# EasyEDA Pro project ProProject_PCB_Prometheus_main.epro

# Schematic Schematic1
Board Name: Board1; Create Date: 2025-01-10; Page Name: P1; Project Name: vr_tag; Schematic Name: Schematic1; Update Date: 2025-08-10; Company: EasyEDA.com; Page Size: A4; Version: V1.0
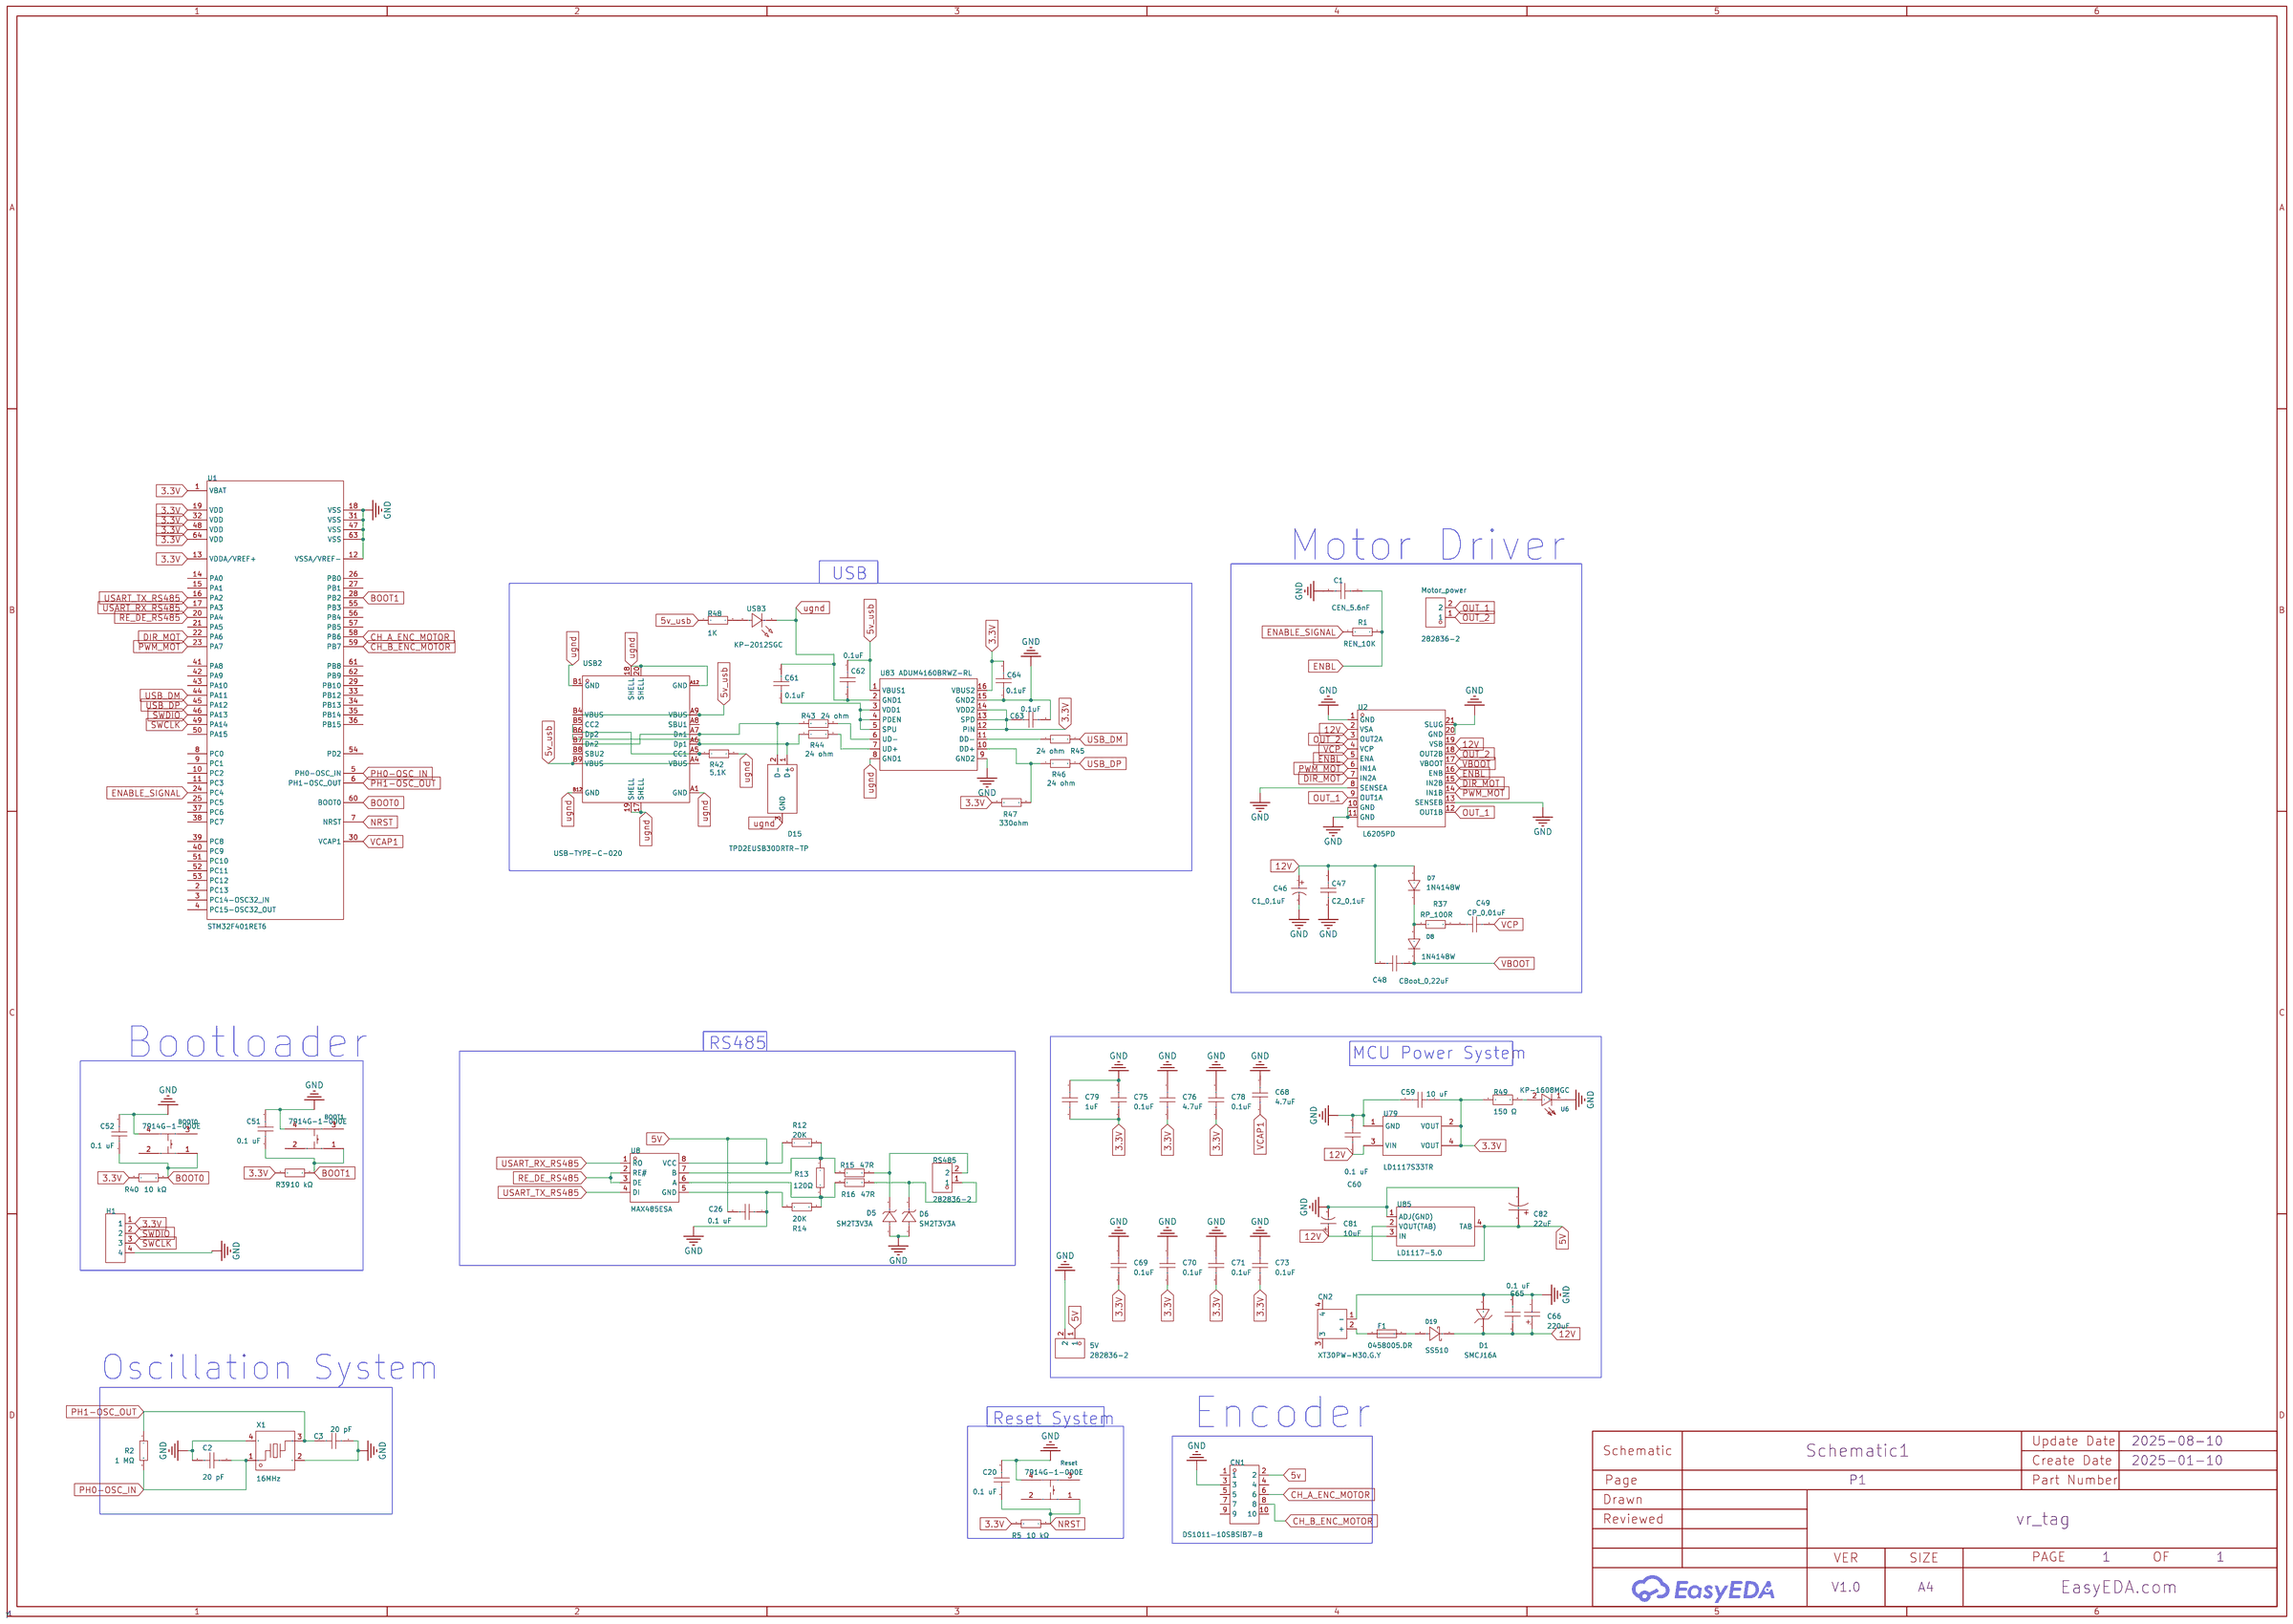
[diagram p0: schematic sheet]

## Parts
5V  282836-2  [CONN-TH_2P-P5.00_282836-2]
BOOT0  7914G-1-000E  [KEY-SMD_4P-L5.0-W5.0-P2.54-LS5.5-BL]
BOOT1  7914G-1-000E  [KEY-SMD_4P-L5.0-W5.0-P2.54-LS5.5-BL]
C1  CEN_5.6nF  [C0603]
C2  20 pF  [C0603]
C3  20 pF  [C0603]
C20  0.1 uF  [C0603]
C26  0.1 uF  [C0603]
C46  C1_0,1uF  [CASE-A_3216]
C47  C2_0,1uF  [C0603]
C48  CBoot_0,22uF  [C0603]
C49  CP_0,01uF  [C0603]
C51  0.1 uF  [C0603]
C52  0.1 uF  [C0603]
C59  10 uF  [C0603]
C60  0.1 uF  [C0603]
C61  0.1uF  [C0603]
C62  0.1uF  [C0603]
C63  0.1uF  [C0603]
C64  0.1uF  [C0603]
C65  0.1 uF  [C0603]
C66  220uF  [CASE-E_7343]
C68  4.7uF  [C0603]
C69  0.1uF  [C0603]
C70  0.1uF  [C0603]
C71  0.1uF  [C0603]
C73  0.1uF  [C0603]
C75  0.1uF  [C0603]
C76  4.7uF  [C0603]
C78  0.1uF  [C0603]
C79  1uF  [C0603]
C81  10uF  [CAP-SMD_BD5.0-L5.3-W5.3-LS6.3-FD]
C82  22uF  [CAP-SMD_BD5.0-L5.3-W5.3-LS6.3-FD]
CN1  DS1011-10SBSiB7-B  [CONN-TH_DS1011-10SBSIB7-B]
CN2  XT30PW-M30.G.Y  [CONN-TH_XT30PW-M]
D1  SMCJ16A  [SMC_L6.9-W5.9-LS7.9-RD]
D5  SM2T3V3A  [DO-216AA_L1.9-W1.9-LS3.8-FD]
D6  SM2T3V3A  [DO-216AA_L1.9-W1.9-LS3.8-FD]
D7  1N4148W  [SOD-123FL_L2.7-W1.6-LS3.8-RD]
D8  1N4148W  [SOD-123FL_L2.7-W1.6-LS3.8-RD]
D15  TPD2EUSB30DRTR-TP  [SOT-723-3_L1.2-W0.8-LS1.20-BR]
D19  SS510  [SMB_L4.3-W3.6-LS5.4-RD]
F1  0458005.DR  [F1206]
H1  -  [HDR-TH_4P-P2.54-V-M]
Motor_power  282836-2  [CONN-TH_2P-P5.00_282836-2]
R1  REN_10K  [R0603]
R2  1 MΩ  [R0603]
R5  10 kΩ  [R0603]
R12  20K  [R0603]
R13  120Ω  [R1206]
R14  20K  [R0603]
R15  47R  [R0603]
R16  47R  [R0603]
R37  RP_100R  [R0603]
R39  10 kΩ  [R0603]
R40  10 kΩ  [R0603]
R42  5,1K  [R0603]
R43  24 ohm  [R0603]
R44  24 ohm  [R0603]
R45  24 ohm  [R0603]
R46  24 ohm  [R0603]
R47  330ohm  [R0603]
R48  1K  [R0603]
R49  150 Ω  [R0805]
Reset  7914G-1-000E  [KEY-SMD_4P-L5.0-W5.0-P2.54-LS5.5-BL]
RS485  282836-2  [CONN-TH_2P-P5.00_282836-2]
U1  STM32F401RET6  [LQFP-64_L10.0-W10.0-P0.50-LS12.0-BL]
U2  L6205PD  [POWERSO20_L15.9-W11.0-P1.27-LS14.2-BL-EP]
U6  KP-1608MGC  [LED0603-RD_GREEN]
U8  MAX485ESA  [SOIC-8_L4.9-W3.9-P1.27-LS6.0-BL]
U79  LD1117S33TR  [SOT-223_L6.5-W3.5-P2.30-LS7.0-BR]
U83  ADUM4160BRWZ-RL  [SOIC-16_L10.3-W7.5-P1.27-LS10.3-BL]
U85  LD1117-5.0  [SOT-223_L6.7-W3.5-P2.30-BR]
USB2  USB-TYPE-C-020  [USB-SMD_USB-TYPE-C-020]
USB3  KP-2012SGC  [LED0805-RD]
X1  16MHz  [CRYSTAL-SMD_4P-L5.0-W3.2-BL]

## Library data of the parts
5V Motor_power RS485 = 282836-2: Pitch:5mm Color:Green Mounting Style:Direct Insert Current Rating (Max):13.5A Voltage Rating (Max):300V Number of Pins:2P Number of Rows:1 Wire Gauge - AWG:16~30 Wire Gauge - AWG:16~30 Number of PINs Per Row:2; LCSC Part Name: 5mm 排数:1 每排P数:2 直插; Supplier Part: C590402; Manufacturer: TE Connectivity(泰科电子); Supplier Footprint: 插件,P=5mm; JLCPCB Part Class: Extended Part; Datasheet: https://atta.szlcsc.com/upload/public/pdf/source/20240119/1DE6D9456CCE01F1F664469E3029A1B4.pdf; Supplier: LCSC; Pitch: 5mm; Color: Green; Mounting Style: Direct Insert; Current Rating (Max): 13.5A; Voltage Rating (Max): 300V; Number of Pins: 2P; Number of Rows: 1; Wire Gauge - AWG: 16~30; Number of PINs Per Row: 2
BOOT0 BOOT1 Reset = 7914G-1-000E: Circuit:SPST-常开 Actuator Style:Round Button Operating Force:300gf Mounting Style:Brick nogging Contact Current:100mA Voltage Rating (DC):16V IP Rating:IP67 Pin Style:Gull Wing Operating Temperature:-55℃~+125℃ Operating Temperature:-55℃~+125℃; Supplier Part: C840653; Manufacturer: BOURNS; JLCPCB Part Class: Extended Part; Supplier: LCSC; Circuit: SPST-常开; Actuator Style: Round Button; Operating Force: 300gf; Mounting Style: Brick nogging; Contact Current: 100mA; Voltage Rating (DC): 16V; IP Rating: IP67; Pin Style: Gull Wing; Operating Temperature: -55℃~+125℃
C1-C3 C20 C26 C47-C49 C51 C52 C59-C65 C68-C71 C73 C75 C76 C78 C79 = CAP_0603: Supplier Footprint: 0603
C46 = CA45-A016K106T: Capacitance: Tolerance:±10% Tolerance:±10% Rated Voltage: Equivalent Series Resistance(ESR):3Ω@100kHz Operating Temperature:-55℃~+125℃ Operating Temperature:-55℃~+125℃; LCSC Part Name: 10uF ±10% 16V; Supplier Part: C119051; Manufacturer: 湘怡中元/湘江; Supplier Footprint: CASE-A-3216; JLCPCB Part Class: Extended Part; Datasheet: https://atta.szlcsc.com/upload/public/pdf/source/20191009/C435293_78A410F3D73489DBEAC46056C4262F7A.pdf; Supplier: LCSC; Tolerance: ±10%; Equivalent Series Resistance(ESR): 3Ω@100kHz; Operating Temperature: -55℃~+125℃
C66 = TAJE227K016RNJ: Capacitance: Tolerance:±10% Tolerance:±10% Rated Voltage: Equivalent Series Resistance(ESR):500mΩ@100kHz Operating Temperature:-55℃~+125℃ Operating Temperature:-55℃~+125℃; LCSC Part Name: 220uF ±10% 16V; Supplier Part: C7231; Manufacturer: Kyocera AVX; Supplier Footprint: CASE-E-7343; JLCPCB Part Class: Extended Part; Datasheet: https://atta.szlcsc.com/upload/public/pdf/source/20160107/1457707750344.pdf; Supplier: LCSC; Tolerance: ±10%; Equivalent Series Resistance(ESR): 500mΩ@100kHz; Operating Temperature: -55℃~+125℃
C81 = RVT1V100M0505_C72486: Capacitance: Tolerance:±20% Tolerance:±20% Rated Voltage: Ripple Current:22mA@120Hz Equivalent Series Resistance(ESR):- φD: L: Lifetime @ Temp:2000hrs@105℃ Operating Temperature:-40℃~+105℃ Operating Temperature:-40℃~+105℃; LCSC Part Name: 10uF ±20% 35V; Supplier Part: C72486; Manufacturer: ROQANG(容强); Manufacturer Part: RVT1V100M0505; Supplier Footprint: SMD,D5xL5.4mm; JLCPCB Part Class: Extended Part; Datasheet: https://atta.szlcsc.com/upload/public/pdf/source/20170325/1490427950282.pdf; Supplier: LCSC; Tolerance: ±20%; Ripple Current: 22mA@120Hz; Lifetime @ Temp: 2000hrs@105℃; Operating Temperature: -40℃~+105℃
C82 = RVT1C220M0505_C335979: Capacitance: Tolerance:±20% Tolerance:±20% Rated Voltage: Ripple Current:28mA@120Hz Equivalent Series Resistance(ESR):- φD: L: Lifetime @ Temp:2000hrs@105℃ Operating Temperature:-40℃~+105℃ Operating Temperature:-40℃~+105℃; LCSC Part Name: 22uF ±20% 16V; Supplier Part: C335979; Manufacturer: ROQANG(容强); Manufacturer Part: RVT1C220M0505; Supplier Footprint: SMD,D5xL5.4mm; JLCPCB Part Class: Extended Part; Datasheet: https://atta.szlcsc.com/upload/public/pdf/source/20181128/C335987_23CA7AA50FB42690DF736C43FE112376.pdf; Supplier: LCSC; Tolerance: ±20%; Ripple Current: 28mA@120Hz; Lifetime @ Temp: 2000hrs@105℃; Operating Temperature: -40℃~+105℃
CN1 = DS1011-10SBSiB7-B: Connector Type:Horn buckle Pitch:2.54mm Structure:2x5P Holder Type:Direct Insert Number of Rows:2 Pin Number in each Row:5; LCSC Part Name: 2.54mm 2x5P 排数:2 每排P数:5; Supplier Part: C7431121; Manufacturer: CONNFLY; Supplier Footprint: 插件,P=2.54mm; JLCPCB Part Class: Extended Part; Datasheet: https://atta.szlcsc.com/upload/public/pdf/source/20230712/2FDCF289B77CC493F4A9FD01D240CC71.pdf; Supplier: LCSC; Connector Type: Horn buckle; Pitch: 2.54mm; Structure: 2x5P; Holder Type: Direct Insert; Number of Rows: 2; Pin Number in each Row: 5
CN2 = XT30PW-M30.G.Y: Power:- Output:- Input:- Size:- Interface:- Type:- Colour:- MaximumCurrent:- Type:Aviation model plug RatedVoltage:DC 500V Type1:- NumberOfUSBHoles:- InterfaceType:Male head MetalMaterial:- InsulationMaterial:- RatedCurrent:15A RecommendedWireGauge:16/18/; LCSC Part Name: AMASS(艾迈斯)航模插头 卧式弯脚 XT30PW-M公头; Supplier Part: C431092; Manufacturer: AMASS(艾迈斯); JLCPCB Part Class: Extended Part; Datasheet: https://atta.szlcsc.com/upload/public/pdf/source/20220222/6A9F22F7850E25B33E1BE430ADF8560B.pdf; Supplier: LCSC; Type: Aviation model plug; RatedVoltage: DC 500V; InterfaceType: Male head; RatedCurrent: 15A; RecommendedWireGauge: 16/18/20AWG; contact resistance: 1.2mΩ; specifications: 2pin
D1 = SMCJ16A_C310019: Reverse Stand-Off Voltage (Vrwm):16V Maximum Clamping Voltage:26V Peak Pulse Current (Ipp)@10/1000us:57.7A Breakdown Voltage:17.8V Type:TVS; Supplier Part: C310019; Manufacturer: Brightking(君耀电子); Supplier Footprint: SMC(DO-214AB); JLCPCB Part Class: Extended Part; Datasheet: https://atta.szlcsc.com/upload/public/pdf/source/20181127/C310089_DF11A7ED4CCF9CC3586EB1D10F86E9D6.pdf; Supplier: LCSC; Reverse Stand-Off Voltage (Vrwm): 16V; Maximum Clamping Voltage: 26V; Peak Pulse Current (Ipp)@10/1000us: 57.7A; Breakdown Voltage: 17.8V; Type: TVS
D5 D6 = SM2T3V3A: Reverse Stand-Off Voltage (Vrwm):3.3V Maximum Clamping Voltage:6.8V Peak Pulse Current (Ipp)@10/1000us:25A Peak Pulse Power Dissipation (Ppp)@10/1000us:200W Breakdown Voltage:3.6V Reverse Leakage Current (Ir):500uA Type:TVS; LCSC Part Name: 单向TVS 3.3V截止 25A峰值脉冲; Supplier Part: C970557; Manufacturer: ST(意法半导体); Supplier Footprint: DO-216AA; JLCPCB Part Class: Extended Part; Datasheet: https://atta.szlcsc.com/upload/public/pdf/source/20201211/C970557_EBE10214B1FDEDE84815AE73A3ED0A7F.pdf; Supplier: LCSC; Reverse Stand-Off Voltage (Vrwm): 3.3V; Maximum Clamping Voltage: 6.8V; Peak Pulse Current (Ipp)@10/1000us: 25A; Peak Pulse Power Dissipation (Ppp)@10/1000us: 200W; Breakdown Voltage: 3.6V; Reverse Leakage Current (Ir): 500uA; Type: TVS
D7 D8 = 1N4148W_C143180: Diode Configuration: Forward Voltage (Vf@If):1.25V@150mA Reverse Voltage (Vr): Average Rectified Current (Io): Power Dissipation: Reverse Leakage Current:2.5uA@75V Reverse Recovery Time (trr): Operating Temperature:-55℃~+150℃@(Tj) Operating Temperature:-5; LCSC Part Name: 电压:75V 电流:150mA; Supplier Part: C143180; Manufacturer: FMS(美丽微); Supplier Footprint: SOD-123; JLCPCB Part Class: Extended Part; Datasheet: https://atta.szlcsc.com/upload/public/pdf/source/20171109/C143180_15102201600451103731.pdf; Supplier: LCSC; Forward Voltage (Vf@If): 1.25V@150mA; Reverse Leakage Current: 2.5uA@75V; Operating Temperature: -55℃~+150℃@(Tj)
D15 = TPD2EUSB30DRTR-TP: Supplier Part: C2844720; Manufacturer: TECH PUBLIC(台舟); Supplier Footprint: SOT-723-3; JLCPCB Part Class: Extended Part; Datasheet: https://atta.szlcsc.com/upload/public/pdf/source/20210910/0ECB21791D44DF637915A47DDFBF4563.pdf; Supplier: LCSC
D19 = SS510_C2898359: Diode Configuration:Single Forward Voltage (Vf@If):850mV@5A Reverse Voltage (Vr):100V Average Rectified Current (Io):5A Reverse Leakage Current (Ir):300uA@100V; LCSC Part Name: 电压:100V 电流:5A; Supplier Part: C2898359; Manufacturer: YFW(佑风微); Supplier Footprint: SMB; JLCPCB Part Class: Extended Part; Datasheet: https://atta.szlcsc.com/upload/public/pdf/source/20211008/1A631543609D8D3463D9A042ED2C10D9.pdf; Supplier: LCSC; Diode Configuration: Single; Forward Voltage (Vf@If): 850mV@5A; Reverse Voltage (Vr): 100V; Average Rectified Current (Io): 5A; Reverse Leakage Current (Ir): 300uA@100V
F1 = 0458005.DR: Type:SMD Fuse Current Rating:5A Voltage Rating  (AC):32V Voltage Rating (DC):75V Operating Temperature:-55℃~+125℃ Operating Temperature:-55℃~+125℃ Breaking Capacity:50A; LCSC Part Name: 32V贴片式保险丝; Supplier Part: C187561; Manufacturer: Littelfuse(美国力特); Supplier Footprint: 1206; JLCPCB Part Class: Extended Part; Datasheet: https://atta.szlcsc.com/upload/public/pdf/source/20180516/C206980_034D7586635BABA90823EE318961734D.pdf; Supplier: LCSC; Type: SMD Fuse; Current Rating: 5A; Voltage Rating  (AC): 32V; Voltage Rating (DC): 75V; Operating Temperature: -55℃~+125℃; Breaking Capacity: 50A
H1 = HDR-M_2.54_1x4P: Supplier Footprint: Through
R1 R2 R5 R12 R14-R16 R37 R39 R40 R42-R48 = Res_0603: Supplier Footprint: 0603
R13 = 1206W4J0121T5E: Type:Thick Film Resistors Resistance: Tolerance:±5% Tolerance:±5% Power(Watts): Overload Voltage (Max): Temperature Coefficient:±100ppm/℃ Temperature Coefficient:±100ppm/℃ Operating Temperature Range:-55℃~+155℃ Operating Temperature Range:-55℃~+155℃; LCSC Part Name: 120Ω ±5% 250mW 厚膜电阻; Supplier Part: C25351; Manufacturer: UNI-ROYAL(厚声); Supplier Footprint: 1206; JLCPCB Part Class: Extended Part; Datasheet: https://atta.szlcsc.com/upload/public/pdf/source/20200306/C422600_1E6D84923E4A46A82E41ADD87F860B5C.pdf; Supplier: LCSC; Type: Thick Film Resistors; Tolerance: ±5%; Temperature Coefficient: ±100ppm/℃; Operating Temperature Range: -55℃~+155℃
R49 = ERJ6ENF2053V: Type:Thick Film Resistors Resistance:205kΩ Tolerance:±1% Tolerance:±1% Power(Watts): Overload Voltage (Max):- Temperature Coefficient:±100ppm/℃ Temperature Coefficient:±100ppm/℃ Operating Temperature Range:-55℃~+155℃ Operating Temperature Range:-55℃~+155℃; LCSC Part Name: 205kΩ ±1% 125mW 厚膜电阻; Supplier Part: C2077507; Manufacturer: PANASONIC(松下); Supplier Footprint: 0805; JLCPCB Part Class: Extended Part; Datasheet: https://atta.szlcsc.com/upload/public/pdf/source/20240116/DC5257A3024E44D37E518C2D5EB5F78B.pdf; Supplier: LCSC; Type: Thick Film Resistors; Tolerance: ±1%; Temperature Coefficient: ±100ppm/℃; Operating Temperature Range: -55℃~+155℃
U1 = STM32F401RET6: CPU Core:ARM-M4 Program Storage Size:512KB GPIO Ports Number:50 Operating Voltage Range:1.7V~3.6V Operating Voltage Range:1.7V~3.6V CPU Maximum Speed:84MHz Operating Temperature Range:-40℃~+85℃ Operating Temperature Range:-40℃~+85℃ ADC (Bit):12bit Univers; LCSC Part Name: 带DSP和FPU的STM32动态效率ARM Cortex-M4 MCU，具有最大512 KB Flash、84 MHz CPU和ART加速器; Supplier Part: C116978; Manufacturer: ST(意法半导体); Supplier Footprint: LQFP-64(10x10); JLCPCB Part Class: Extended Part; Datasheet: https://atta.szlcsc.com/upload/public/pdf/source/20180130/C161736_15172973410651323369.pdf; Supplier: LCSC; CPU Core: ARM-M4; Program Storage Size: 512KB; GPIO Ports Number: 50; Operating Voltage Range: 1.7V~3.6V; CPU Maximum Speed: 84MHz; Operating Temperature Range: -40℃~+85℃; ADC (Bit): 12bit; Universal Serial Bus: Yes; Watchdog: Yes; Infrared Data Association: Yes; Low-Voltage Detect: Yes; Secure Digital Input and Output: Yes; Direct Memory Access: Yes; Internal Oscillator: Yes
U2 = L6205PD: Supplier Part: C1523898; Manufacturer: ST(意法半导体); Supplier Footprint: PowerSO-20; JLCPCB Part Class: Extended Part; Datasheet: https://atta.szlcsc.com/upload/public/pdf/source/20201127/C962257_F77061A1191C4A10F81925AEC8B998BA.pdf; Supplier: LCSC
U6 = KP-1608MGC: Supplier Part: C598258; Manufacturer: Kingbright; Supplier Footprint: SMD; JLCPCB Part Class: Extended Part; Supplier: LCSC
U8 = MAX485ESA_C5279041: Supplier Part: C5279041; Manufacturer: TWGMC(台湾迪嘉); Supplier Footprint: SOP-8; JLCPCB Part Class: Extended Part; Datasheet: https://atta.szlcsc.com/upload/public/pdf/source/20221123/28407831C9A9BE6EF87858D2D3D1ED55.pdf; Supplier: LCSC
U79 = LD1117S33TR: Output Type:Fixed Maximum Input Voltage:15V Output Voltage:3.3V Output Voltage:3.3V Output Current:800mA Power Supply Rejection Ratio (PSRR):75dB@(120Hz) Dropout Voltage:1.2V@(800mA) standby current:10mA Feature:Thermal Protection(TSD)；Overcurrent Protect; LCSC Part Name: 可调与固定低压降正电压稳压器; Supplier Part: C86781; Manufacturer: ST(意法半导体); Supplier Footprint: SOT-223; JLCPCB Part Class: Extended Part; Datasheet: https://atta.szlcsc.com/upload/public/pdf/source/20181022/C283467_00098992BB1D287195B66486CE33A2DD.pdf; Supplier: LCSC; Output Type: Fixed; Maximum Input Voltage: 15V; Output Voltage: 3.3V; Output Current: 800mA; Power Supply Rejection Ratio (PSRR): 75dB@(120Hz); Dropout Voltage: 1.2V@(800mA); standby current: 10mA; Feature: Thermal Protection(TSD)；Overcurrent Protection(OCP); Operating Temperature: 0℃~+125℃; Output Polarity: Positive electrode; Number of Outputs: 1
U83 = ADUM4160BRWZ-RL_C57791: LCSC Part Name: 全速/低速5kVUSB数字隔离器; Supplier Part: C57791; Manufacturer: ADI(亚德诺); Supplier Footprint: SOIC-16-300mil; JLCPCB Part Class: Extended Part; Datasheet: https://atta.szlcsc.com/upload/public/pdf/source/20180327/C57791_1A1DC0BD2A9501538E79ECF10A1F69DF.pdf; Supplier: LCSC
U85 = LD1117-5.0: Output Type:Fixed Maximum Input Voltage:18V Output Voltage:5V Output Voltage:5V Output Current:1A Power Supply Rejection Ratio (PSRR):60dB@(120Hz) Dropout Voltage:1.3V@(1A) standby current:10mA Noise:- Feature:Overcurrent Protection(OCP) Operating Tempera; LCSC Part Name: 1A 低压差线性稳压器; Supplier Part: C347230; Manufacturer: UMW(友台半导体); Supplier Footprint: SOT-223; JLCPCB Part Class: Extended Part; Datasheet: https://atta.szlcsc.com/upload/public/pdf/source/20241218/8288C7B0045F441821724C5C6ED32029.pdf; Supplier: LCSC; Output Type: Fixed; Maximum Input Voltage: 18V; Output Voltage: 5V; Output Current: 1A; Power Supply Rejection Ratio (PSRR): 60dB@(120Hz); Dropout Voltage: 1.3V@(1A); standby current: 10mA; Feature: Overcurrent Protection(OCP); Operating Temperature: -40℃~+125℃@(Tj); Output Polarity: Positive electrode; Number of Outputs: 1
USB2 = USB-TYPE-C-020: Connector Type:Type-C Standard:- Gender:Female Number of Ports:1 Number of Contacts:16P Mounting Style:卧贴 Current Rating - Power (Max):3A Operating Temperature Range:-25℃~+85℃ Operating Temperature Range:-25℃~+85℃; LCSC Part Name: Type-C 母 卧贴; Supplier Part: C2927040; Manufacturer: DEALON(德艺隆); Supplier Footprint: SMD; JLCPCB Part Class: Extended Part; Datasheet: https://atta.szlcsc.com/upload/public/pdf/source/20211217/7DCA1D6718C928159CC0455E6B85EBF0.pdf; Supplier: LCSC; Connector Type: Type-C; Gender: Female; Number of Ports: 1; Number of Contacts: 16P; Mounting Style: 卧贴; Current Rating - Power (Max): 3A; Operating Temperature Range: -25℃~+85℃
USB3 = KP-2012SGC: Emitted Color:Green-yellow Power Dissipation:62.5mW Forward Current:20mA Dominant Wavelength:568nm Dominant Wavelength:568nm Peak Wavelength:565nm Diode Configuration:- Lens Color:无色透明透镜 Color Temperature:- Color Temperature:- Viewing Angle:160° Mounting; LCSC Part Name: 普绿/黄绿; Supplier Part: C598280; Manufacturer: Kingbright; Supplier Footprint: 0805; JLCPCB Part Class: Extended Part; Datasheet: https://atta.szlcsc.com/upload/public/pdf/source/20200812/C598280_201E8F392B103474BC5803322D11338C.pdf; Supplier: LCSC; Emitted Color: Green-yellow; Power Dissipation: 62.5mW; Forward Current: 20mA; Dominant Wavelength: 568nm; Peak Wavelength: 565nm; Lens Color: 无色透明透镜; Viewing Angle: 160°; Operating Temperature: -40℃~+85℃
X1 = HY13MSMD50324POB1R10: Frequency: External load capacitor:20pF Frequency Stability(Full temperature range):±10ppm Frequency Stability(Full temperature range):±10ppm Equivalent Series Resistance (ESR):50Ω; LCSC Part Name: 13MHz 20pF; Supplier Part: C7275144; Manufacturer: Huiyuan crystal(惠源晶工); Supplier Footprint: SMD5032-4P; JLCPCB Part Class: Extended Part; Datasheet: https://atta.szlcsc.com/upload/public/pdf/source/20230530/D0430CADBE2CD60CA30268FC8461A922.pdf; Supplier: LCSC; External load capacitor: 20pF; Frequency Stability(Full temperature range): ±10ppm; Equivalent Series Resistance (ESR): 50Ω

## Nets
3.3V: C59.1 C63.1 C64.2 C69.2 C70.2 C71.2 C73.2 C75.2 C76.2 C78.2 C79.2 H1.1 R5.1 R39.1 R40.1 R47.1 R49.1 U1.1(VBAT) U1.13(VDDA/VREF+) U1.19(VDD) U1.32(VDD) U1.48(VDD) U1.64(VDD) U79.2(VOUT) U79.4(VOUT) U83.12(PIN) U83.13(SPD) U83.14(VDD2) U83.16(VBUS2)
5v: CN1.2
5V: 5V.1 C26.2 C82.1 R12.1 U8.8(VCC) U85.2(VOUT(TAB)) U85.4(TAB)
5v_usb: C62.1 R48.1 U83.1(VBUS1) USB2.A4(VBUS) USB2.A9(VBUS) USB2.B4(VBUS) USB2.B9(VBUS)
12V: C46.1 C47.1 C48.2 C60.1 C65.1 C66.1 C81.1 D1.1 D7.2(A) D19.1(K) U2.2(VSA) U2.19(VSB) U79.3(VIN) U85.3(IN)
GND: 5V.2 BOOT0.4 BOOT1.4 C1.2 C2.2 C3.1 C20.2 C26.1 C46.2 C47.2 C51.2 C52.2 C59.2 C60.2 C63.2 C64.1 C65.2 C66.2 C68.1 C69.1 C70.1 C71.1 C73.1 C75.1 C76.1 C78.1 C79.1 C81.2 C82.2 CN1.3 CN2.1(-) D1.2 D5.1(A) D6.1(A) H1.4 R14.1 Reset.4 U1.12(VSSA/VREF-) U1.18(VSS) U1.31(VSS) U1.47(VSS) U1.63(VSS) U2.1(GND) U2.8(SENSEA) U2.10(GND) U2.11(GND) U2.13(SENSEB) U2.20(GND) U2.21(SLUG) U6.1(C) U8.5(GND) U79.1(GND) U83.9(GND2) U83.15(GND2) U85.1(ADJ(GND)) X1.2(GND) X1.4(GND)
BOOT0: BOOT0.1 C52.1 R40.2 U1.60(BOOT0)
BOOT1: BOOT1.1 C51.1 R39.2 U1.28(PB2)
CH_A_ENC_MOTOR: CN1.6 U1.58(PB6)
CH_B_ENC_MOTOR: CN1.8 U1.59(PB7)
DIR_MOT: U1.22(PA6) U2.7(IN2A) U2.15(IN2B)
ENABLE_SIGNAL: R1.1 U1.24(PC4)
ENBL: C1.1 R1.2 U2.5(ENA) U2.16(ENB)
NRST: C20.1 R5.2 Reset.1 U1.7(NRST)
OUT_1: Motor_power.2 U2.9(OUT1A) U2.12(OUT1B)
OUT_2: Motor_power.1 U2.3(OUT2A) U2.18(OUT2B)
PH0-OSC_IN: C2.1 R2.2 U1.5(PH0-OSC_IN)
PH1-OSC_OUT: C3.2 R2.1 U1.6(PH1-OSC_OUT) X1.3
PWM_MOT: U1.23(PA7) U2.6(IN1A) U2.14(IN1B)
RE_DE_RS485: U1.20(PA4) U8.2(RE#) U8.3(DE)
SWCLK: H1.3 U1.49(PA14)
SWDIO: H1.2 U1.46(PA13)
ugnd: C61.2 C62.2 D15.3(GND) R42.2 U83.2(GND1) U83.8(GND1) USB2.17(SHELL) USB2.18(SHELL) USB2.19(SHELL) USB2.20(SHELL) USB2.A1(GND) USB2.A12(GND) USB2.B1(GND) USB2.B12(GND) USB3.1(K)
USART_RX_RS485: U1.17(PA3) U8.1(RO)
USART_TX_RS485: U1.16(PA2) U8.4(DI)
USB_DM: R45.2 U1.44(PA11)
USB_DP: R46.2 U1.45(PA12)
VBOOT: C48.1 D8.1(K) U2.17(VBOOT)
VCAP1: C68.2 U1.30(VCAP1)
VCP: C49.1 U2.4(VCP)
$1N3060: C49.2 R37.2
$1N3062: D7.1(K) D8.2(A) R37.1
$1N3999: R13.2 R14.2 R16.1 U8.6(A)
$1N4005: R12.2 R13.1 R15.1 U8.7(B)
$1N4007: D5.2(K) R15.2 RS485.2
$1N4008: D6.2(K) R16.2 RS485.1
$1N5677: R43.2 U83.6(UD-)
$1N5678: R44.2 U83.7(UD+)
$1N5680: R45.1 U83.11(DD-)
$1N5682: R46.1 R47.2 U83.10(DD+)
$1N5684: C61.1 U83.3(VDD1) U83.4(PDEN) U83.5(SPU)
$1N5687: R48.2 USB3.2(A)
$1N5689: R42.1 USB2.A5(CC1) USB2.B5(CC2)
$1N5692: D15.2(D-) R43.1 USB2.A7(Dn1) USB2.B7(Dn2)
$1N5693: D15.1(D+) R44.1 USB2.A6(Dp1) USB2.B6(Dp2)
$1N6880: R49.2 U6.2(A)
$1N7190: CN2.2(+) F1.1
$1N13001: D19.2(A) F1.2

Not connected (* = marked no-connect by the designer): BOOT0 2 3; BOOT1 2 3; CN1 1 4 5 7 9 10; CN2 3 4; Reset 2 3; U1 2(PC13) 3(PC14-OSC32_IN) 4(PC15-OSC32_OUT) 8(PC0) 9(PC1) 10(PC2) 11(PC3) 14(PA0) 15(PA1) 21(PA5) 25(PC5) 26(PB0) 27(PB1) 29(PB10) 33(PB12) 34(PB13) 35(PB14) 36(PB15) 37(PC6) 38(PC7) 39(PC8) 40(PC9) 41(PA8) 42(PA9) 43(PA10) 50(PA15) 51(PC10) 52(PC11) 53(PC12) 54(PD2) 55(PB3) 56(PB4) 57(PB5) 61(PB8) 62(PB9); USB2 A8(SBU1) B8(SBU2); X1 1

## Notes on the sheet
- Motor Driver
- USB
- RS485
- Bootloader
- MCU Power System
- Oscillation System
- Reset System
- Encoder

# Board PCB1
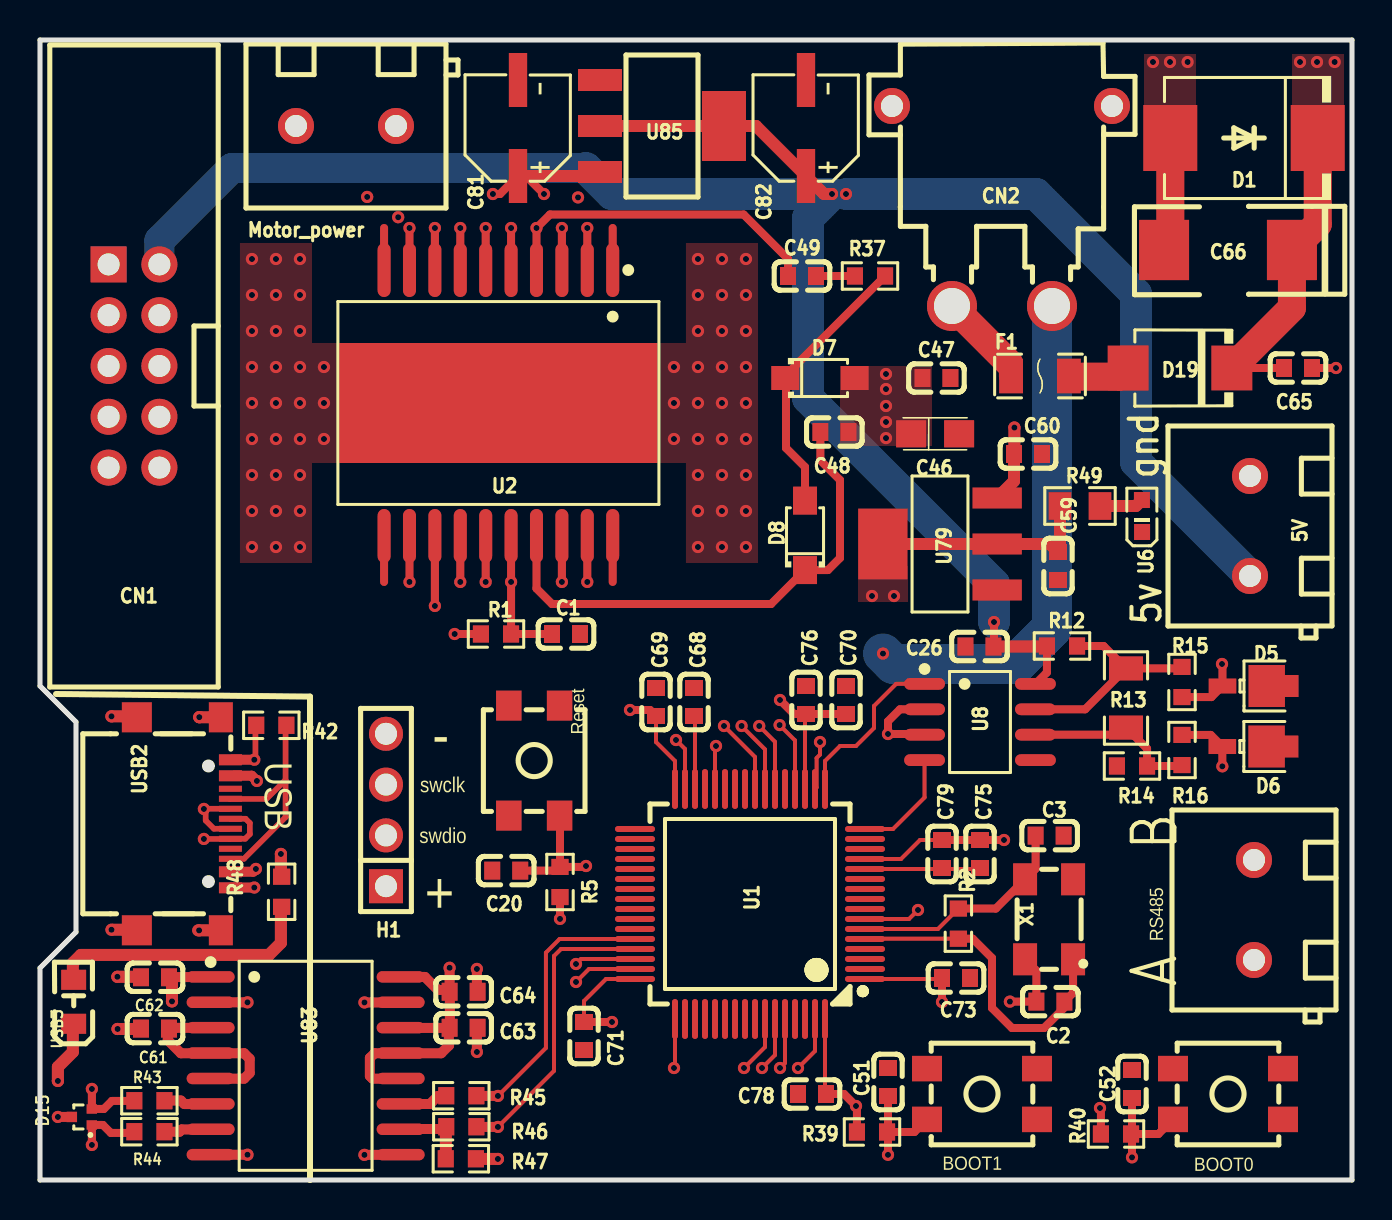
[diagram p1: board, top side]
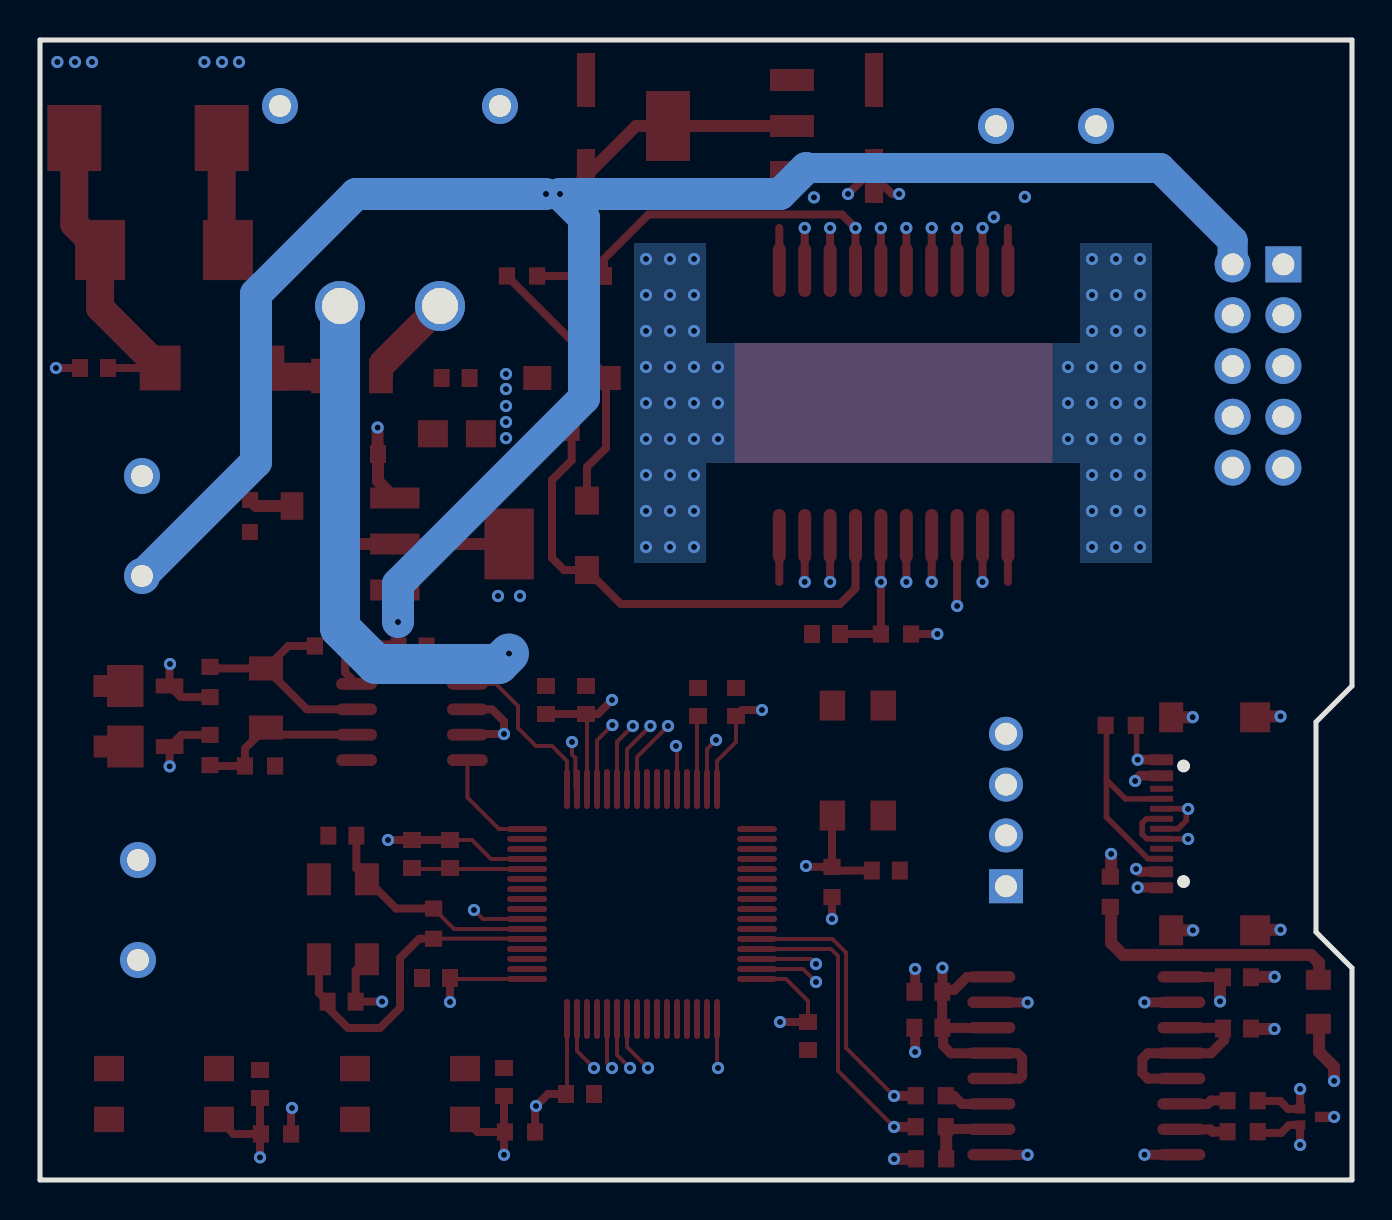
[diagram p2: board, bottom side, seen from below]

Outline 65.6 x 57 mm; copper layers: Top Layer, Inner1, Inner2, Bottom Layer. Coordinates in mm from the lower left corner of the outline.
Outline path: 0,57 0,24.7 1.8,22.9 1.8,12.4 0,10.6 0,0 65.6,0 65.6,57 0,57
Stack: Top Layer 0.035mm / Dielectric1 1.51mm FR4 er 4.5 / Inner1 0.035mm / Dielectric2 0.48mm PP er 4.5 / Inner2 0.035mm / Dielectric3 0.48mm PP er 4.5 / Bottom Layer 0.035mm

## Design rules (mm)
template: Custom Config
spacing copperThickness1oz: track to track 0.3, other pairs 0.3 to 0.3
spacing copperThickness2oz (default): track to track 0.203, other pairs 0.17 to 0.3
track width copperThickness1oz (default): min 0.127, default 0.4, max 2
track width copperThickness2oz: min 0.203, default 0.254, max 2.54
differential pair differentialPair (default): width min 0.127, default 0.254, max 2.54; gap min 0.152, default 0.152
via viaSize (default): diameter min 0.5, default 0.61, max 10; hole min 0.3, default 0.305, max 6.3

## Placement (name value [footprint] x y rotation side)
5V  282836-2  [CONN-TH_2P-P5.00_282836-2]  60.5 32.7 90 top
BOOT0  7914G-1-000E  [KEY-SMD_4P-L5.0-W5.0-P2.54-LS5.5-BL]  59.4 4.3 0 top
BOOT1  7914G-1-000E  [KEY-SMD_4P-L5.0-W5.0-P2.54-LS5.5-BL]  47.1 4.3 0 top
C1  CEN_5.6nF  [C0603]  26.3 27.3 0 top
C2  20 pF  [C0603]  50.52 8.92 180 top
C3  20 pF  [C0603]  50.48 17.22 180 top
C20  0.1 uF  [C0603]  23.31 15.47 180 top
C26  0.1 uF  [C0603]  46.97 26.68 0 top
C46  C1_0,1uF  [CASE-A_3216]  44.76 37.31 0 top
C47  C2_0,1uF  [C0603]  44.82 40.1 0 top
C48  CBoot_0,22uF  [C0603]  39.72 37.4 0 top
C49  CP_0,01uF  [C0603]  38.1 45.2 0 top
C51  0.1 uF  [C0603]  42.4 4.9 90 top
C52  0.1 uF  [C0603]  54.6 4.8 90 top
C59  10 uF  [C0603]  50.9 30.7 270 top
C60  0.1 uF  [C0603]  49.4 36.3 0 top
C61  0.1uF  [C0603]  5.75 7.57 180 top
C62  0.1uF  [C0603]  5.75 10.14 180 top
C63  0.1uF  [C0603]  21.18 7.61 0 top
C64  0.1uF  [C0603]  21.18 9.41 180 top
C65  0.1 uF  [C0603]  62.9 40.6 0 top
C66  220uF  [CASE-E_7343]  59.4 46.5 0 top
C68  4.7uF  [C0603]  32.7 23.9 270 top
C69  0.1uF  [C0603]  30.8 23.9 270 top
C70  0.1uF  [C0603]  40.3 24 270 top
C71  0.1uF  [C0603]  27.2 7.2 90 top
C73  0.1uF  [C0603]  45.8 10.1 180 top
C75  0.1uF  [C0603]  47 16.3 90 top
C76  4.7uF  [C0603]  38.3 24 270 top
C78  0.1uF  [C0603]  38.6 4.3 0 top
C79  1uF  [C0603]  45.1 16.3 90 top
C81  10uF  [CAP-SMD_BD5.0-L5.3-W5.3-LS6.3-FD]  23.9 52.6 90 top
C82  22uF  [CAP-SMD_BD5.0-L5.3-W5.3-LS6.3-FD]  38.3 52.6 90 top
CN1  DS1011-10SBSiB7-B  [CONN-TH_DS1011-10SBSIB7-B]  4.7 40.7 90 top
CN2  XT30PW-M30.G.Y  [CONN-TH_XT30PW-M]  48.1 48.7 180 top
D1  SMCJ16A  [SMC_L6.9-W5.9-LS7.9-RD]  60.2 52.1 180 top
D5  SM2T3V3A  [DO-216AA_L1.9-W1.9-LS3.8-FD]  60.4 24.7 180 top
D6  SM2T3V3A  [DO-216AA_L1.9-W1.9-LS3.8-FD]  60.39 21.67 180 top
D7  1N4148W  [SOD-123FL_L2.7-W1.6-LS3.8-RD]  39 40.1 0 top
D8  1N4148W  [SOD-123FL_L2.7-W1.6-LS3.8-RD]  38.25 32.23 90 top
D15  TPD2EUSB30DRTR-TP  [SOT-723-3_L1.2-W0.8-LS1.20-BR]  2.09 3.15 0 top
D19  SS510  [SMB_L4.3-W3.6-LS5.4-RD]  57 40.6 180 top
F1  0458005.DR  [F1206]  50 40.2 0 top
H1  -  [HDR-TH_4P-P2.54-V-M]  17.3 18.5 90 top
Motor_power  282836-2  [CONN-TH_2P-P5.00_282836-2]  15.3 52.7 180 top
R1  REN_10K  [R0603]  22.8 27.3 0 top
R2  1 MΩ  [R0603]  45.92 12.82 270 top
R5  10 kΩ  [R0603]  26 14.9 90 top
R12  20K  [R0603]  51.1 26.7 0 top
R13  120Ω  [R1206]  54.3 24.1 270 top
R14  20K  [R0603]  54.6 20.7 0 top
R15  47R  [R0603]  57.1 24.9 270 top
R16  47R  [R0603]  57.1 21.5 90 top
R37  RP_100R  [R0603]  41.5 45.2 180 top
R39  10 kΩ  [R0603]  41.6 2.4 0 top
R40  10 kΩ  [R0603]  53.8 2.3 0 top
R42  5,1K  [R0603]  11.57 22.73 180 top
R43  24 ohm  [R0603]  5.47 3.96 0 top
R44  24 ohm  [R0603]  5.47 2.41 0 top
R45  24 ohm  [R0603]  21.07 4.21 0 top
R46  24 ohm  [R0603]  21.07 2.66 0 top
R47  330ohm  [R0603]  21.04 1.06 180 top
R48  1K  [R0603]  12.08 14.41 270 top
R49  150 Ω  [R0805]  52 33.7 0 top
Reset  7914G-1-000E  [KEY-SMD_4P-L5.0-W5.0-P2.54-LS5.5-BL]  24.71 20.97 90 top
RS485  282836-2  [CONN-TH_2P-P5.00_282836-2]  60.7 13.5 90 top
U1  STM32F401RET6  [LQFP-64_L10.0-W10.0-P0.50-LS12.0-BL]  35.5 13.8 90 top
U2  L6205PD  [POWERSO20_L15.9-W11.0-P1.27-LS14.2-BL-EP]  22.92 38.85 180 top
U6  KP-1608MGC  [LED0603-RD_GREEN]  55.1 33.2 90 top
U8  MAX485ESA  [SOIC-8_L4.9-W3.9-P1.27-LS6.0-BL]  47 22.9 270 top
U79  LD1117S33TR  [SOT-223_L6.5-W3.5-P2.30-LS7.0-BR]  45 31.8 0 top
U83  ADUM4160BRWZ-RL  [SOIC-16_L10.3-W7.5-P1.27-LS10.3-BL]  13.28 5.71 270 top
U85  LD1117-5.0  [SOT-223_L6.7-W3.5-P2.30-BR]  31.1 52.7 180 top
USB2  USB-TYPE-C-020  [USB-SMD_USB-TYPE-C-020]  7.18 17.81 270 top
USB3  KP-2012SGC  [LED0805-RD]  1.68 8.91 90 top
X1  16MHz  [CRYSTAL-SMD_4P-L5.0-W3.2-BL]  50.45 13.04 90 top

## Footprints (pads in the part's own frame, mm; a bottom-side part is the same pattern mirrored in y, then rotated)
C0603
  rect 0.8x0.9 smd: 1(-0.7,0) 2(0.7,0)
CAP-SMD_BD5.0-L5.3-W5.3-LS6.3-FD
  rect 2.7x0.91 smd: 1(-2.4,0) 2(2.4,0)
CASE-A_3216
  rect 1.5x1.359 smd: 1(-1.2,0) 2(1.2,0)
CASE-E_7343
  rect 2.5x3.01 smd: 1(3.196,0) 2(-3.196,0)
CONN-TH_2P-P5.00_282836-2
  round 1.8 hole 1.1: 1(-2.5,0) 2(2.5,0)
CONN-TH_DS1011-10SBSIB7-B
  rect 1.8x1.8 hole 1.1: 1(5.08,1.27)
  round 1.8 hole 1.1: 2(5.08,-1.27) 3(2.54,1.27) 4(2.54,-1.27) 5(0,1.27) 6(0,-1.27) 7(-2.54,1.27) 8(-2.54,-1.27) 9(-5.08,1.27) 10(-5.08,-1.27)
CONN-TH_XT30PW-M
  round 2.5 hole 1.8: 1(-2.5,5) 2(2.5,5)
  round 1.8 hole 1.1: 3(5.5,-5) 4(-5.5,-5)
CRYSTAL-SMD_4P-L5.0-W3.2-BL
  rect 1.6x1.2 smd: 1(-2,-1.2) 2(2,-1.2) 3(2,1.2) 4(-2,1.2)
DO-216AA_L1.9-W1.9-LS3.8-FD
  custom 2.5x2.1 smd: 1(-1.276,0)
  rect 1.38x0.75 smd: 2(1.276,0)
F1206
  rect 1.19x1.728 smd: 1(-1.445,0) 2(1.445,0)
HDR-TH_4P-P2.54-V-M
  rect 1.7x1.7 hole 1.1: 1(-3.81,0)
  round 1.7 hole 1.1: 2(-1.27,0) 3(1.27,0) 4(3.81,0)
KEY-SMD_4P-L5.0-W5.0-P2.54-LS5.5-BL
  rect 1.5x1.273 smd: 1(-2.75,-1.27) 2(2.75,-1.27) 3(2.75,1.27) 4(-2.75,1.27)
LED0603-RD_GREEN
  rect 0.8x0.8 smd: 1(-0.799,-0.004) 2(0.799,0.004)
LED0805-RD
  rect 1x1.25 smd: 1(-1.1,0) 2(1.1,0)
LQFP-64_L10.0-W10.0-P0.50-LS12.0-BL
  oval 0.3x2 smd: 1(-3.75,-5.75) 2(-3.25,-5.75) 3(-2.75,-5.75) 4(-2.25,-5.75) 5(-1.75,-5.75) 6(-1.25,-5.75) 7(-0.75,-5.75) 8(-0.25,-5.75) 9(0.25,-5.75) 10(0.75,-5.75) 11(1.25,-5.75) 12(1.75,-5.75) 13(2.25,-5.75) 14(2.75,-5.75) 15(3.25,-5.75) 16(3.75,-5.75) 33(3.75,5.75) 34(3.25,5.75) 35(2.75,5.75) 36(2.25,5.75) 37(1.75,5.75) 38(1.25,5.75) 39(0.75,5.75) 40(0.25,5.75) 41(-0.25,5.75) 42(-0.75,5.75) 43(-1.25,5.75) 44(-1.75,5.75) 45(-2.25,5.75) 46(-2.75,5.75) 47(-3.25,5.75) 48(-3.75,5.75)
  oval 2x0.3 smd: 17(5.75,-3.75) 18(5.75,-3.25) 19(5.75,-2.75) 20(5.75,-2.25) 21(5.75,-1.75) 22(5.75,-1.25) 23(5.75,-0.75) 24(5.75,-0.25) 25(5.75,0.25) 26(5.75,0.75) 27(5.75,1.25) 28(5.75,1.75) 29(5.75,2.25) 30(5.75,2.75) 31(5.75,3.25) 32(5.75,3.75) 49(-5.75,3.75) 50(-5.75,3.25) 51(-5.75,2.75) 52(-5.75,2.25) 53(-5.75,1.75) 54(-5.75,1.25) 55(-5.75,0.75) 56(-5.75,0.25) 57(-5.75,-0.25) 58(-5.75,-0.75) 59(-5.75,-1.25) 60(-5.75,-1.75) 61(-5.75,-2.25) 62(-5.75,-2.75) 63(-5.75,-3.25) 64(-5.75,-3.75)
POWERSO20_L15.9-W11.0-P1.27-LS14.2-BL-EP
  oval 0.651x2.696 smd: 1(-5.715,-6.647) 2(-4.445,-6.647) 3(-3.175,-6.647) 4(-1.905,-6.647) 5(-0.635,-6.647) 6(0.635,-6.647) 7(1.905,-6.647) 8(3.175,-6.647) 9(4.445,-6.647) 10(5.715,-6.647) 11(5.715,6.647) 12(4.445,6.647) 13(3.175,6.647) 14(1.905,6.647) 15(0.635,6.647) 16(-0.635,6.647) 17(-1.905,6.647) 18(-3.175,6.647) 19(-4.445,6.647) 20(-5.715,6.647)
  rect 15.9x6 smd: 21(0,0)
R0603
  rect 0.806x0.864 smd: 1(-0.753,0) 2(0.753,0)
R0805
  rect 1.133x1.377 smd: 1(-1,0) 2(1,0)
R1206
  rect 1.208x1.701 smd: 1(-1.479,0) 2(1.479,0)
SMB_L4.3-W3.6-LS5.4-RD
  rect 2.047x2.241 smd: 1(-2.591,0) 2(2.591,0)
SMC_L6.9-W5.9-LS7.9-RD
  rect 2.7x3.3 smd: 1(-3.687,0) 2(3.687,0)
SOD-123FL_L2.7-W1.6-LS3.8-RD
  rect 1.4x1.2 smd: 1(-1.735,0) 2(1.735,0)
SOIC-8_L4.9-W3.9-P1.27-LS6.0-BL
  oval 0.588x2.045 smd: 1(-1.905,-2.772) 2(-0.635,-2.772) 3(0.635,-2.772) 4(1.905,-2.772) 5(1.905,2.772) 6(0.635,2.772) 7(-0.635,2.772) 8(-1.905,2.772)
SOIC-16_L10.3-W7.5-P1.27-LS10.3-BL
  oval 0.574x2.401 smd: 1(-4.445,-4.75) 2(-3.175,-4.75) 3(-1.905,-4.75) 4(-0.635,-4.75) 5(0.635,-4.75) 6(1.905,-4.75) 7(3.175,-4.75) 8(4.445,-4.75) 9(4.445,4.75) 10(3.175,4.75) 11(1.905,4.75) 12(0.635,4.75) 13(-0.635,4.75) 14(-1.905,4.75) 15(-3.175,4.75) 16(-4.445,4.75)
SOT-223_L6.5-W3.5-P2.30-LS7.0-BR
  rect 2.465x1.05 smd: 1(2.857,-2.3) 2(2.857,0) 3(2.857,2.3)
  rect 2.465x3.54 smd: 4(-2.857,0)
SOT-223_L6.7-W3.5-P2.30-BR
  rect 2.2x1.1 smd: 1(3.099,-2.3) 2(3.099,0) 3(3.099,2.3)
  rect 2.2x3.5 smd: 4(-3.099,0)
SOT-723-3_L1.2-W0.8-LS1.20-BR
  rect 0.52x0.47 smd: 1(0.5,-0.4) 2(0.5,0.4)
  rect 0.52x0.52 smd: 3(-0.5,0)
USB-SMD_USB-TYPE-C-020
  rect 1.5x1.2 smd: 17(-5.325,1.86) 18(5.325,1.86)
  rect 1.5x1.5 smd: 19(-5.325,-2.34) 20(5.325,-2.34)
  rect 0.3x1.15 smd: A1(-3.325,2.34) A4(-2.525,2.34) A5(-1.25,2.34) A6(-0.25,2.34) A7(0.25,2.34) A8(1.25,2.34) A9(2.525,2.34) A12(3.325,2.34) B1(3.075,2.34) B4(2.275,2.34) B5(1.75,2.34) B6(0.75,2.34) B7(-0.75,2.34) B8(-1.75,2.34) B9(-2.275,2.34) B12(-3.075,2.34)

## Nets
As in the schematic, except:
5V: 5V.1 C26.2 C82.1 CN1.2 R12.1 U8.8 U85.2 U85.4
5V_USB: C62.1 R48.1 U83.1 USB2.A4 USB2.A9 USB2.B4 USB2.B9
PH0-OSC_IN: C2.1 R2.2 U1.5 X1.1
UGND: C61.2 C62.2 D15.3 R42.2 U83.2 U83.8 USB2.17 USB2.18 USB2.19 USB2.20 USB2.A1 USB2.A12 USB2.B1 USB2.B12 USB3.1

Pads without a net: BOOT0 2 3; BOOT1 2 3; CN1 1 4 5 7 9 10; CN2 3 4; Reset 2 3; U1 2 3 4 8 9 10 11 14 15 21 25 26 27 29 33 34 35 36 37 38 39 40 41 42 43 50 51 52 53 54 55 56 57 61 62; USB2 A8 B8

## Via types
v1: diameter 0.61, hole 0.305, Top Layer to Bottom Layer, 158 vias

## Routing (per net, layer and track width the routed paths; a pad name or vN(x,y) marks a point on that pad's centre or on a via; arc(x,y) is an arc through that point)
3.3V: length 68
  Top Layer w0.2: C69.2 30.8,21.9 31.75,20.95 U1.32 ; C78.2 39.25,4.35 U1.64 ; C73.2 45.05,10.05 U1.1 ; C79.2 44,17 43.05,16.05 U1.13 ; C76.2 38.25,23.25 U1.19 ; C71.2 27.2,8.95 28.3,10.05 U1.48
  Top Layer w0.4: C78.2 40.2,4.3 v1(40.8,3.7) 40.85,3.65 R39.1 ; C79.2 C75.2 v1(48.2,17) ; v1(45.1,8.9) C73.2 ; C69.2 30.5,23.5 v1(29.5,23.5) ; C70.2 C76.2 37.7,23.3 v1(37,24) ; R5.1 v1(26,13.06) ; v1(28.6,7.9) C71.2 ; R40.1 53.05,3.55 v1(53,3.6)
  Top Layer w0.5: 20.44,7.6 20.49,7.65 20.49,9.4 20.39,9.5 ; 20.44,7.6 20.44,6.74 20.45,6.73 20.06,6.34 16.73,6.34 16.49,6.1 16.49,5.2 16.63,5.07 18.07,5.07 ; 20.44,7.6 18.08,7.6 18.07,7.61 ; v1(20.48,10.61) 20.48,9.59 20.39,9.5 ; 20.39,9.5 19.89,9.5 19.24,10.15 18.08,10.15 18.07,10.15
  Top Layer w0.6: R49.1 51,31.5 C59.1 50.5,31.8 U79.2 U79.4 ; v1(22.89,1.05) 21.8,1.05
  vias: v1(41.6,29.2) v1(42.7,29.2)
5V: length 115.4
  Top Layer w0.4: C26.2 47.7,26.7 v1(47.7,27.9) ; U8.8 50.35,25.38 R12.1
  Top Layer w0.6: U85.2 U85.4 35.8,52.7 C82.1 39.2,49.3 v1(39.6,49.3) ; R12.1 50.32,26.68 C26.2
  Bottom Layer w0.6: v1(40.3,49.3) v1(39.6,49.3)
  Bottom Layer w1.5: CN1.2 5.97,46.97 9.6,50.6 27.3,50.6
  Bottom Layer w1.6: 27.3,50.6 28.6,49.3 v1(39.6,49.3) 38.4,48.1 38.4,39.1 47.7,29.8 v1(47.7,27.9) ; v1(40.3,49.3) 49.8,49.3 54.8,44.3 54.8,35.9 5V.1
5V_USB: length 7.5
  Top Layer w0.5: v1(10.84,19.95) 10.58,20.21 9.67,20.21 ; v1(10.79,15.55) 10.66,15.41 9.63,15.41 9.62,15.4 ; 9.07,10.15 6.67,10.15 6.59,10
  Top Layer w0.6: v1(12.04,16.3) 12.04,15.16 ; v1(6.6,8.93) 6.6,10 6.59,10 6.59,10.15
12V: length 31.3
  Top Layer w0.4: U2.2 v1(27.36,47.6) ; v1(22.64,49.3) 23,49.3 C81.1 ; U2.19 v1(27.36,29.9) ; v1(25.2,49.3) 24.3,50.2 ; C65.1 D19.1
  Top Layer w0.6: U85.3 27.8,50.2 C81.1 ; U79.3 48.7,34.94 C60.1 48.72,36.32 v1(48.72,37.62)
  Top Layer w1.4: D1.1 63.89,47.79 C66.1 62.6,43.61 D19.1
  vias: v1(42.3,40.3) v1(42.3,39.55) v1(42.3,38.7) v1(42.3,37.9) v1(42.3,37.09) v1(63,55.9) v1(63.85,55.9) v1(64.73,55.9)
GND: length 165.1
  Top Layer w0.2: v1(31.8,22) 32.25,21.55 U1.31 ; v1(26.8,9.9) 27.45,10.55 U1.47 ; v1(39,21.9) 39,21.27 38.83,21.1 38.83,19.63 U1.18 ; C75.1 46.95,15.55 U1.12 ; v1(37.9,5.6) 38.75,6.45 U1.63
  Top Layer w0.4: U2.13 v1(19.74,28.7) ; U2.10 17.2,47.6 ; U2.8 v1(19.74,47.6) ; X1.4 49.82,10.47 C2.2 v1(48.49,8.92) ; C65.2 v1(64.8,40.6) ; 17.2,29.9 U2.11 ; U2.1 28.63,47.6 ; U2.20 28.63,29.9
  Top Layer w0.5: v1(16.22,8.88) 18.07,8.88 ; v1(21.84,10.55) 21.84,9.45 21.89,9.4 ; 21.84,6.4 21.84,7.6 ; v1(16.22,1.26) 18.07,1.26
  Top Layer w1.4: D1.2 56.51,46.81 C66.2
  Inner1 w1: CN1.3 1.56,41.38 1.56,31.59 6.9,26.26 13.34,26.26 17.29,22.31 H1.4
  Inner2 w0.4: CN2.1 50.6,43 36.3,28.7 25.71,28.7 23.31,31.1 20.9,31.1 19.74,29.94 ; 19.74,29.94 v1(19.74,28.7) ; 19.74,29.94 19.74,33.26 17.6,35.4 17.6,42.6 19.74,44.74 v1(19.74,47.6)
  Bottom Layer w2: CN2.1 50.6,27.6 48.8,25.8 42.67,25.8 v1(42.15,26.32)
  vias: v1(10.6,46.05) v1(10.6,44.25) v1(10.6,42.45) v1(10.6,40.65) v1(10.6,38.85) v1(10.6,37.05) v1(10.6,35.25) v1(10.6,33.45) v1(10.6,31.65) v1(11.8,46.05) v1(11.8,44.25) v1(11.8,42.45) v1(11.8,40.65) v1(11.8,38.85) v1(11.8,37.05) v1(11.8,35.25) v1(11.8,33.45) v1(11.8,31.65) v1(13,46.05) v1(13,44.25) v1(13,42.45) v1(13,40.65) v1(13,38.85) v1(13,37.05) v1(13,35.25) v1(13,33.45) v1(13,31.65) v1(14.2,40.65) v1(14.2,38.85) v1(14.2,37.05) v1(21.84,6.4) v1(31.7,40.65) v1(31.7,38.85) v1(31.7,37.05) v1(32.9,46.05) v1(32.9,44.25) v1(32.9,42.45) v1(32.9,40.65) v1(32.9,38.85) v1(32.9,37.05) v1(32.9,35.25) v1(32.9,33.45) v1(32.9,31.65) v1(34.1,46.05) v1(34.1,44.25) v1(34.1,42.45) v1(34.1,40.65) v1(34.1,38.85) v1(34.1,37.05) v1(34.1,35.25) v1(34.1,33.45) v1(34.1,31.65) v1(35.3,46.05) v1(35.3,44.25) v1(35.3,42.45) v1(35.3,40.65) v1(35.3,38.85) v1(35.3,37.05) v1(35.3,35.25) v1(35.3,33.45) v1(35.3,31.65) v1(55.65,55.9) v1(56.5,55.9) v1(57.38,55.9)
BOOT0: length 28.6
  Top Layer w0.2: U1.60 37.25,5.85 v1(37,5.6)
  Top Layer w0.4: R40.2 55.92,2.3 BOOT0.1 ; R40.2 54.6,2.35 C52.1 ; R40.2 54.6,2.25 v1(54.6,1.13)
  Inner2 w0.4: v1(37,5.6) 37.23,5.83 37.23,5.88 38.35,7 47.4,7 53.27,1.13 v1(54.6,1.13)
BOOT1: length 31.4
  Top Layer w0.2: U1.28 33.75,21.65 v1(33.8,21.7)
  Top Layer w0.4: BOOT1.1 43.72,2.4 R39.2 ; R39.2 42.4,2.45 C51.1 ; R39.2 42.4,2.35 v1(42.4,1.26)
  Inner1 w0.4: v1(42.4,1.26) 42.4,13.1 v1(33.8,21.7)
CH_A_ENC_MOTOR: length 56.3
  Top Layer w0.2: U1.58 36.25,6.65 v1(35.2,5.6)
  Inner1 w0.4: CN1.6 6.37,41.1 7,41.1 8.58,39.52 8.58,30.38 9.46,29.5 16.8,29.5 36,10.3 36,6.4 35.87,6.28 35.82,6.28 35.42,5.88 35.42,5.83 v1(35.2,5.6)
CH_B_ENC_MOTOR: length 53.6
  Top Layer w0.2: U1.59 36.75,6.25 v1(36.1,5.6)
  Inner1 w0.4: CN1.8 7.8,36.33 7.8,29.83 9.05,28.57 16.18,28.57 34.52,10.23 34.52,5.32 34.95,4.9 35.45,4.9 35.87,5.32 35.87,5.38 v1(36.1,5.6)
DIR_MOT: length 48.3
  Top Layer w0.2: U1.22 36.75,21.91 v1(35.96,22.7)
  Top Layer w0.4: U2.15 v1(22.28,29.9) ; U2.7 v1(21.01,47.6)
  Inner1 w0.4: v1(21.01,47.6) 21,47.59 21,45.3 17.4,41.7 17.4,36.3 19.7,34 19.7,30 20.6,29.1 21.48,29.1 v1(22.28,29.9)
  Inner2 w0.4: v1(22.28,29.9) 26.18,26 33.45,26 35.96,23.49 v1(35.96,22.7)
ENABLE_SIGNAL: length 20.5
  Top Layer w0.2: v1(34.2,22.7) 35.75,21.15 U1.24
  Top Layer w0.4: v1(20.73,27.3) R1.1
  Inner1 w0.4: v1(34.2,22.7) 25.33,22.7 v1(20.73,27.3)
ENBL: length 31.3
  Top Layer w0.4: C1.1 R1.2 v1(23.55,29.9) U2.16 ; U2.5 v1(23.55,47.6)
  Inner1 w0.4: v1(23.55,29.9) 29,35.35 29,42.15 v1(23.55,47.6)
NRST: length 26.3
  Top Layer w0.2: U1.7 43.45,13.05 v1(43.9,13.5)
  Top Layer w0.4: R5.2 25.82,15.47 C20.1 ; R5.2 26,18.2 Reset.1 ; R5.2 27.25,15.65 v1(27.3,15.7)
  Inner2 w0.4: v1(43.9,13.5) 41.7,15.7 v1(27.3,15.7)
OUT_1: length 69.9
  Top Layer w0.4: U2.9 v1(18.47,47.6) ; U2.12 v1(18.47,29.9)
  Inner1 w1.2: v1(18.47,29.9) 15.9,32.48 15.9,45.03 v1(18.47,47.6)
  Inner1 w1.5: v1(16.36,49.15) 17.86,47.66 18.42,47.66
  Inner1 w2: 12.78,52.73 v1(16.36,49.15)
  Inner2 w0.6: 13.4,52.7 12.83,52.7
  Inner2 w1.2: 18.5,29.9 15.93,32.47 15.93,45.02 18.5,47.6
  Inner2 w1.5: v1(18.47,47.6) 17.9,47.6 17.88,47.62 ; 17.88,47.62 17.86,47.62 ; 17.88,47.62 18.44,47.62 ; 12.8,52.69 11.81,51.7 15.88,47.62 17.86,47.62 ; 12.8,52.69 Motor_power.2 ; 12.8,52.69 17.86,47.62 ; 12.8,52.69 12.76,52.72
  vias: v1(17.91,48.14)
OUT_2: length 73.1
  Top Layer w0.4: U2.18 v1(26.09,29.9) ; U2.3 v1(26.09,47.6)
  Inner1 w1.2: 26.1,48.3 26.1,47.63 ; 26.1,48.3 26.1,48.32 26.9,49.13 ; 26.1,48.3 26.9,49.1 ; 26.09,48.29 v1(26.09,47.6) 26.09,46.69 30.2,42.59 30.2,35.02 26.09,30.91 v1(26.09,29.9)
  Inner1 w2: 26.9,49.1 26.9,50.5 24.7,52.7 Motor_power.1
  Inner2 w1.2: 26.12,47.6 26.12,46.6 30.23,42.5 30.23,34.95 26.12,30.85 26.12,29.9
  Inner2 w2: 17.8,52.73 24.7,52.73 26.9,50.53 v1(26.9,49.13)
PH0-OSC_IN: length 16.3
  Top Layer w0.2: R2.2 41.27,12.07 U1.5
  Top Layer w0.4: X1.1 51.65,9.35 C2.1 51.22,8.62 50.2,7.6 48.6,7.6 47.6,8.6 47.6,11.1 46.64,12.07 R2.2
PH1-OSC_OUT: length 11.4
  Top Layer w0.2: R2.1 44.9,12.55 U1.6
  Top Layer w0.4: R2.1 47.79,13.57 X1.3 49.78,15.56 C3.2
PWM_MOT: length 51.2
  Top Layer w0.2: v1(35.08,22.7) 36.25,21.53 U1.23
  Top Layer w0.4: U2.6 v1(22.28,47.6) ; U2.14 v1(21.01,29.9)
  Inner1 w0.4: v1(21.01,29.9) 21.01,31.25 22.97,33.2 26,33.2 28.4,35.6 28.4,41.9 24.93,45.37 23.93,45.37 22.28,47.02 v1(22.28,47.6)
  Inner2 w0.4: v1(21.01,29.9) 25.52,25.4 33.2,25.4 35.08,23.52 v1(35.08,22.7)
RE_DE_RS485: length 13.7
  Top Layer w0.2: v1(36.98,22.75) 37.75,21.98 U1.20
  Top Layer w0.4: U8.3 44.19,22.3 v1(42.4,22.3) 42.4,22.94 43,23.54 U8.2
  Inner2 w0.4: v1(42.4,22.3) 41.95,22.75 v1(36.98,22.75)
SWCLK: length 24
  Top Layer w0.2: U1.49 31.75,5.65 v1(31.7,5.6)
  Inner1 w0.4: H1.3 24.69,12.38 27.12,12.38 30.7,8.8 30.7,6.6 v1(31.7,5.6)
SWDIO: length 15.2
  Top Layer w0.2: U1.46 27.05,11.05 v1(26.8,10.8)
  Inner1 w0.4: H1.2 23.73,10.8 v1(26.8,10.8)
UGND: length 17.4
  Top Layer w0.28: v1(10.71,21.01) 10.77,21.07 10.77,22.73
  Top Layer w0.5: 10.67,14.62 9.6,14.62 ; v1(0.89,3.15) 1.59,3.15 ; 9.07,1.26 9.08,1.26 v1(10.37,1.26) ; 9.07,8.88 9.08,8.88 v1(10.37,8.88) ; 9.61,21.01 v1(10.71,21.01)
  Top Layer w0.6: v1(7.96,23.14) 7.97,23.14 9,23.14 ; 1.64,7.75 1.64,6.4 0.89,5.65 v1(0.89,4.95) ; 4.8,12.49 4.78,12.51 3.64,12.51 ; v1(3.88,7.55) 5.11,7.55 5.11,7.55 ; 3.57,23.18 4.76,23.18 4.8,23.14 ; 5.11,10.15 5.11,10.16 v1(3.87,10.16) ; 7.9,12.48 9,12.48 9,12.49
  vias: v1(3.57,23.18) v1(3.57,12.51) v1(7.95,12.48) v1(10.71,14.62)
USART_RX_RS485: length 8.6
  Top Layer w0.2: U8.1 42.8,24.81 41.7,23.7 41.7,22.6 40.8,21.7 40,21.7 39.25,20.95 U1.17
USART_TX_RS485: length 5.5
  Top Layer w0.2: U8.4 44.23,19.13 42.65,17.55 U1.16
USB_DM: length 14
  Top Layer w0.2: v1(22.9,4.2) 25.3,6.6 25.3,11.37 25.98,12.05 U1.44
  Top Layer w0.5: v1(22.9,4.2) 21.81,4.2
USB_DP: length 15
  Top Layer w0.2: v1(22.9,2.65) 25.7,5.46 25.7,11.2 26.05,11.55 U1.45
  Top Layer w0.5: 21.81,2.65 21.81,2.65 v1(22.9,2.65)
VBOOT: length 25.8
  Top Layer w0.4: C48.1 39.02,35.98 40,35 40,31.1 39.4,30.5 D8.1 36.55,28.8 25.6,28.8 24.82,29.58 U2.17
VCAP1: length 3.7
  Top Layer w0.2: C68.2 32.75,23.15 U1.30
VCP: length 16.7
  Top Layer w0.4: U2.4 v1(24.82,47.6) 25.5,48.28 35.18,48.28 37.4,46.06 C49.1
$1N3060: length 1.9
  Top Layer w0.4: R37.2 C49.2
$1N3062: length 13.7
  Top Layer w0.4: D8.2 38.25,35.65 37.3,36.6 37.3,40.07 D7.1 37.27,40.21 R37.1
$1N3999: length 8.8
  Top Layer w0.4: U8.6 53.94,22.27 R13.2 55.35,21.57 R14.2 57.05,20.7 R16.1
$1N4005: length 11.1
  Top Layer w0.4: R15.1 57.03,25.58 R13.1 ; R13.1 53.18,26.7 R12.2 ; R13.1 52.26,23.54 U8.7
$1N4007: length 13.8
  Top Layer w0.4: v1(59.1,25.8) 59.12,25.78 D5.2 58.57,24.15 R15.2
  Inner2 w0.6: v1(59.1,25.8) 60.7,24.2 RS485.2
$1N4008: length 13.6
  Top Layer w0.4: R16.2 58.54,22.25 D6.2 v1(59.12,20.68)
  Inner2 w0.6: RS485.1 59.12,12.58 v1(59.12,20.68)
$1N5677: length 2.4
  Top Layer w0.5: 6.23,3.96 6.24,3.97 7.04,3.97 7.22,3.8 8.57,3.8
$1N5678: length 2.4
  Top Layer w0.5: 6.23,2.4 6.24,2.41 6.97,2.41 7.09,2.53 8.57,2.53
$1N5680: length 2.7
  Top Layer w0.5: 20.3,4.2 19.9,4.2 19.5,3.8 18.08,3.8 ; 18.08,3.8 17.78,3.8 ; 18.08,3.8 18.08,3.8 ; 18.08,3.8 18.07,3.8
$1N5682: length 3.7
  Top Layer w0.5: 20.3,2.55 18.09,2.55 18.07,2.53
  Top Layer w0.6: 20.3,2.55 20.29,2.54 20.29,1.05
$1N5684: length 9.8
  Top Layer w0.5: 9.07,5.07 10.2,5.07 10.48,5.35 10.48,6.06 10.2,6.34 7.04,6.34 6.39,6.99 6.39,7.24 6.76,7.61 9.07,7.61
$1N5687: length 13.5
  Top Layer w0.6: 12.04,13.65 12.04,11.85 11.44,11.25 2.04,11.25 1.64,10.85 1.64,9.95
$1N5689: length 11.4
  Top Layer w0.28: 12.28,20.01 12.28,18.14 10.2,16.06 9.48,16.06 ; 12.28,20.01 12.28,22.73 ; 12.28,20.01 11.32,19.05 9.49,19.05 9.48,19.06
$1N5692: length 25.4
  Top Layer w0.28: 9.48,18.56 8.2,18.56 v1(8.19,18.55) 8.28,18.46 8.28,17.97 8.69,17.56 9.48,17.56
  Top Layer w0.4: v1(2.59,4.55) 2.59,3.55 3.19,3.55 3.59,3.95 4.71,3.95 4.72,3.96
  Inner2 w0.6: v1(2.59,4.55) 2.59,17.15 3.99,18.55 v1(8.19,18.55)
$1N5693: length 26.3
  Top Layer w0.28: 8.24,17.05 9.47,17.05 9.48,17.06 10.26,17.06 10.49,17.29 10.49,17.85 10.28,18.06 9.48,18.06
  Top Layer w0.4: 4.72,2.4 4.67,2.35 3.54,2.35 3.14,2.75 2.59,2.75 v1(2.59,1.75)
  Inner2 w0.6: v1(8.19,17.05) 5.84,17.05 4.89,16.1 4.89,4.05 v1(2.59,1.75)
$1N6880: length 2.2
  Top Layer w0.6: R49.2 54.8,33.7 U6.2
$1N7190: length 4.7
  Top Layer w1: 48.45,40.85 48.45,40.17
  Top Layer w1.4: CN2.2 48.45,40.85
$1N13001: length 2.4
  Top Layer w1.4: D19.2 53.97,40.17 52.15,40.17

## Copper pours and planes (outline as drawn; the poured copper is in the pictures)
3.3V on Top Layer: 40.9,30.7 43.4,30.7 43.4,28.9 40.9,28.9
3.3V on Inner2: 15.7,0.7 54.1,0.7 54.1,35 41.32,35 41.6,26.09 15.7,25.99
5V_USB on Inner1: 13.17,24 13.17,0.82 0.24,0.82 0.24,24
12V on Top Layer: 62.6,56.3 65.2,56.3 65.2,53.4 62.6,53.4
12V on Top Layer: 40,40.7 44.6,40.7 44.6,36.7 40,36.7
12V on Inner1: 9.5,57 65.6,57 65.6,28.74 9.5,28.74
GND on Top Layer: 13.2,41.85 15.2,41.85 15.2,35.85 13.2,35.85
GND on Top Layer: 10,46.85 13.6,46.85 13.6,30.85 10,30.85
GND on Top Layer: 33.4,25 14.6,25 14.6,0 65.6,0 65.6,27.48 33.4,27.48
GND on Top Layer: 55.2,56.3 57.8,56.3 57.8,53.4 55.2,53.4
GND on Top Layer: 32.3,46.85 35.9,46.85 35.9,30.85 32.3,30.85
GND on Top Layer: 30.7,41.85 32.7,41.85 32.7,35.85 30.7,35.85
GND on Top Layer: 9.4,25.8 31.99,25.8 31.99,28.8 65.6,28.8 65.6,57 9.4,57
GND on Bottom Layer: 14.6,27.3 65.6,27.3 65.6,0 14.6,0
GND on Bottom Layer: 32.3,46.85 35.9,46.85 35.9,30.85 32.3,30.85
GND on Bottom Layer: 10,46.85 13.6,46.85 13.6,30.85 10,30.85
GND on Bottom Layer: 12.92,41.85 32.92,41.85 32.92,35.85 12.92,35.85
OUT_1 on Inner2: 8.91,56.75 15.6,56.75 15.6,47.14 8.91,47.14
OUT_2 on Inner2: 16.14,56.8 23,56.8 23,50.89 16.14,50.89
UGND on Bottom Layer: 13.17,23.94 13.17,0.82 0.19,0.82 0.19,23.94

## Text on the board
Top Silkscreen Layer: gnd | 5v | A | B | swdio | swclk | USB | + | -
